# Altium schematic sheet Sheet1.SchDoc
size A2 portrait; Organization: Altium Limited; Address1: L3, 12a Rodborough Rd; Address2: Frenchs Forest; Address3: NSW; Address4: Australia 2086
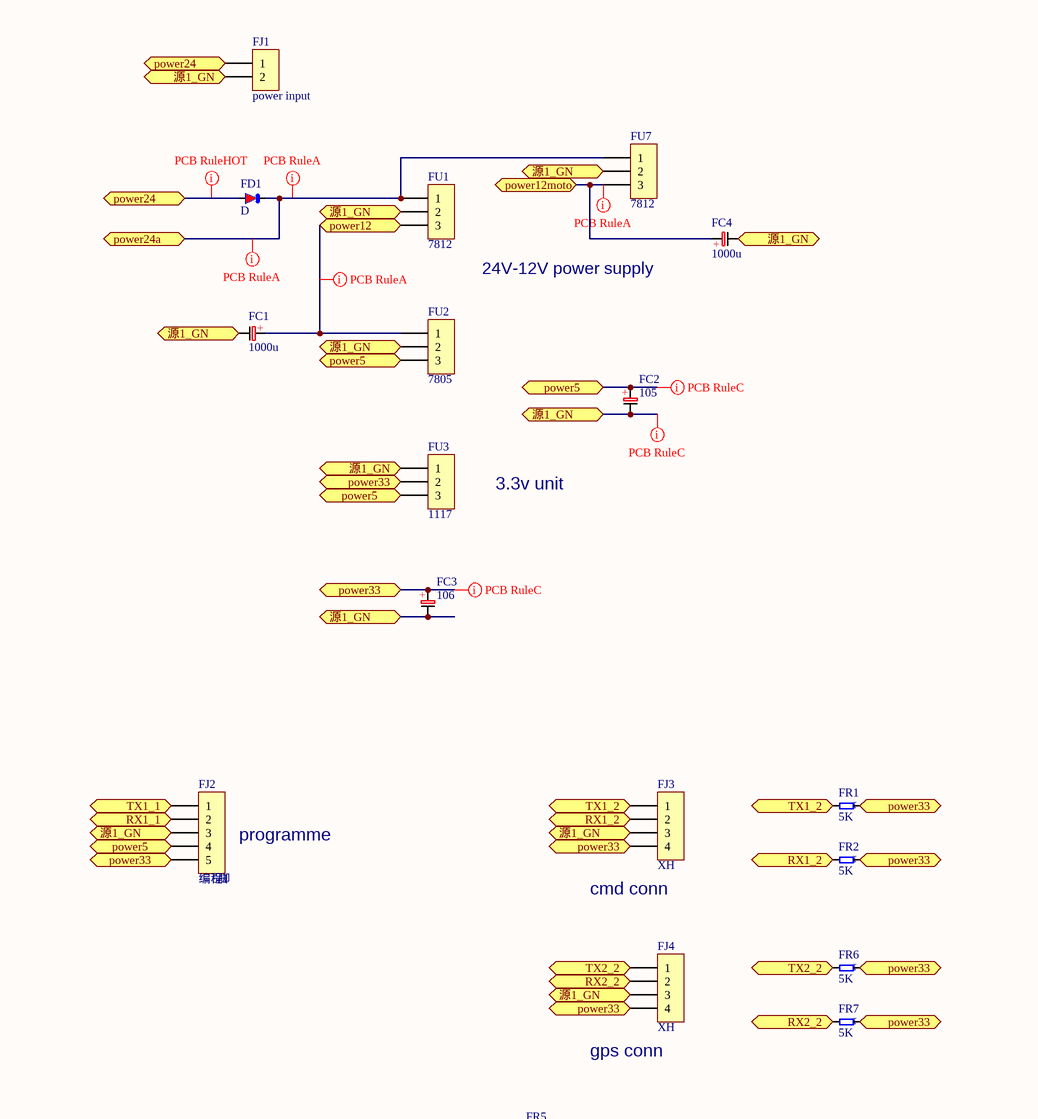
[diagram p0: Sheet1.SchDoc, top]
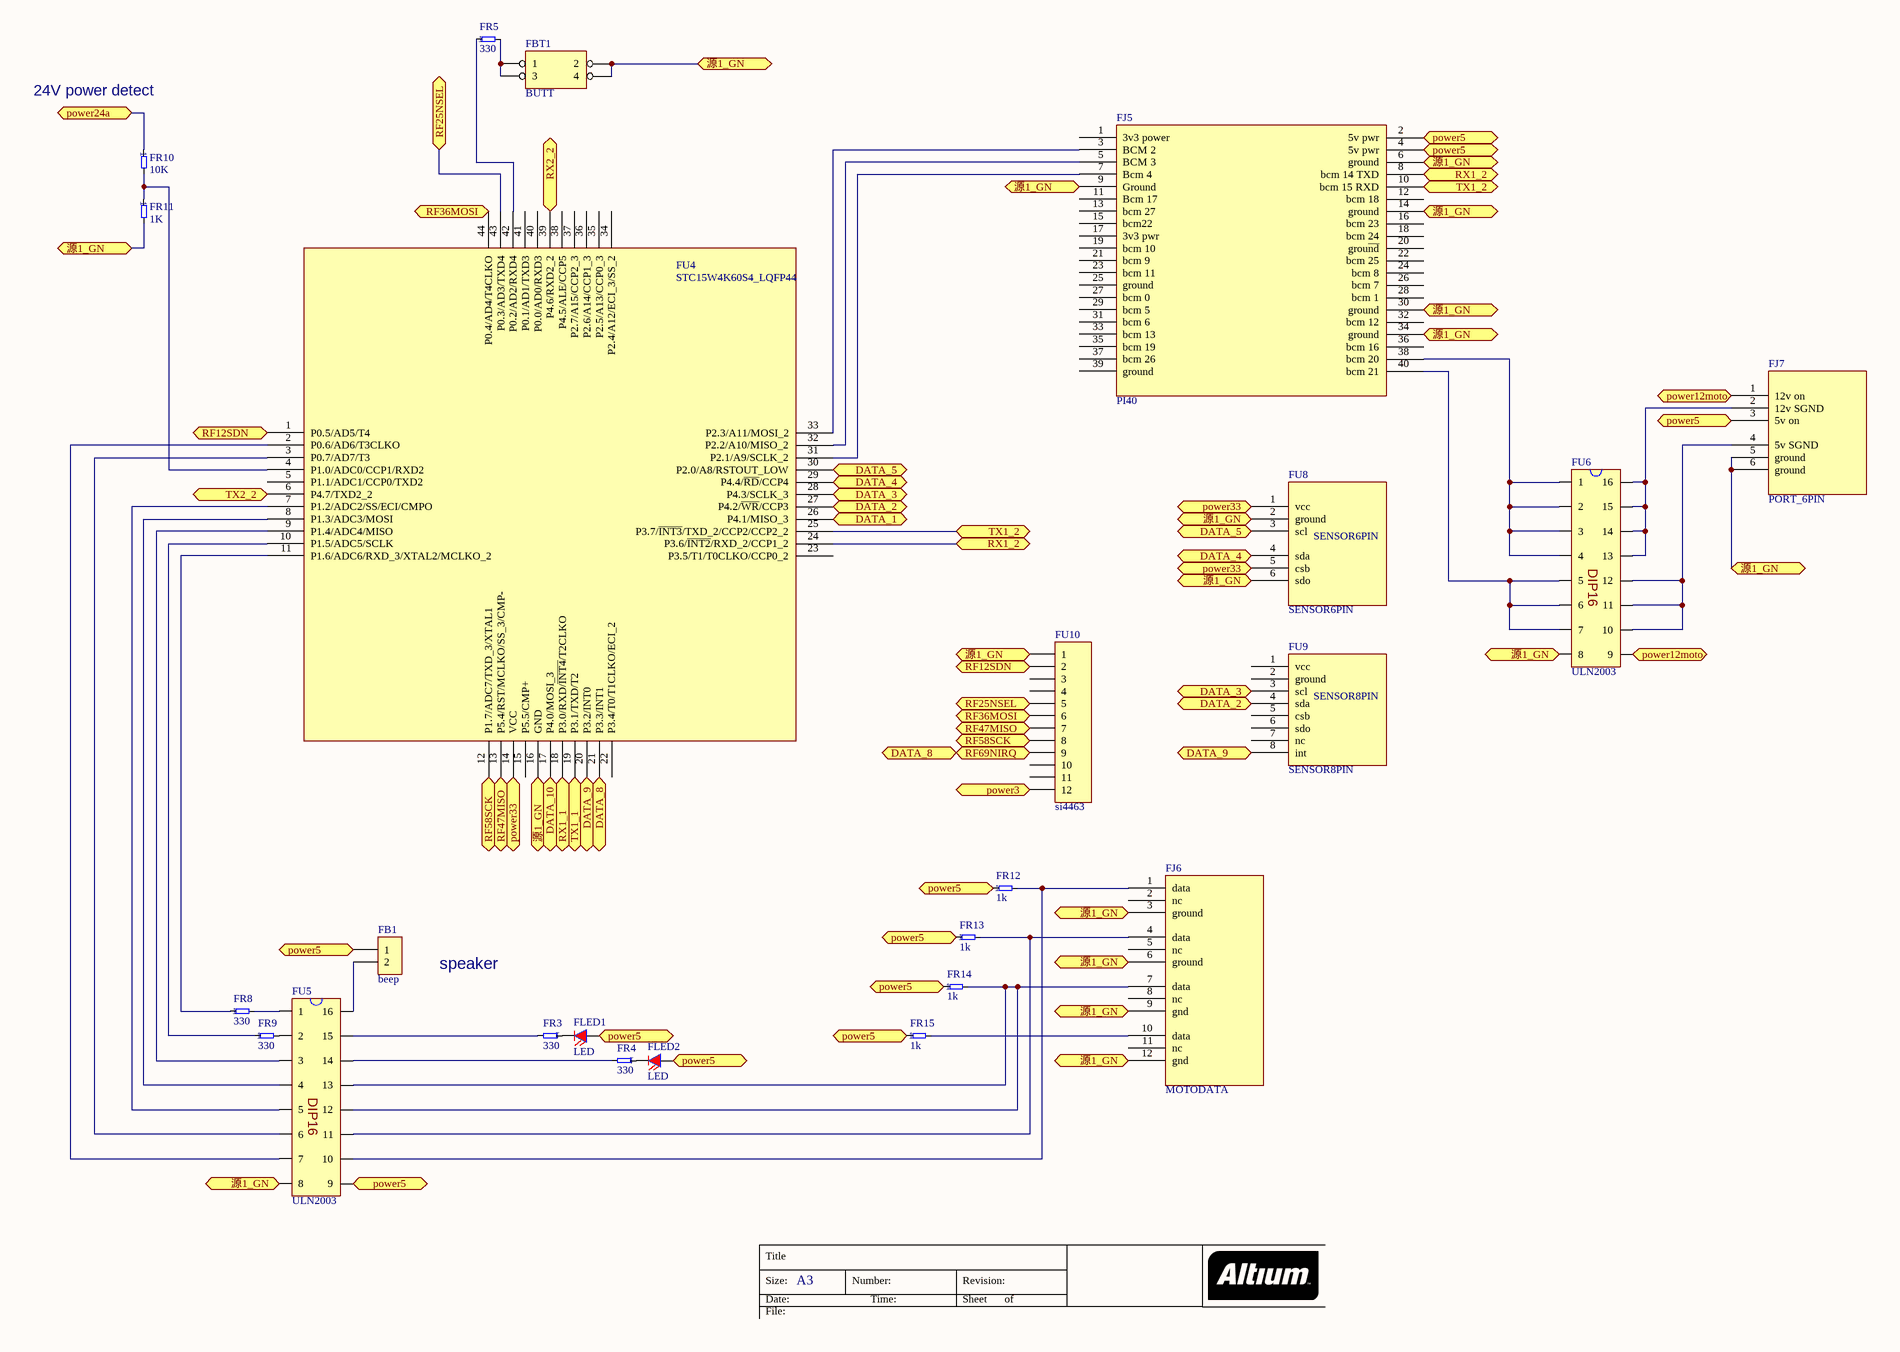
[diagram p1: Sheet1.SchDoc, bottom]

## Parts
FB1  beep  [BEEP_1]
FBT1  BUTT  [BUTT_01]
FC1  1000u  [CD-L_10]
FC2  105  [CAP_10uF]
FC3  106  [CD]
FC4  1000u  [CD-L_10]
FD1  D  [RESIST_1]
FJ1  power input  [DUAN5_2P]
FJ2  5脚  [CONN_PRG3]
FJ3  XH  [XH_P4]
FJ4  XH  [XH_P4]
FJ5  PI40  [PI_CONNECTOR]
FJ6  MOTODATA  [MOTODATA]
FJ7  PORT_6PIN  [DUAN5_6P]
FLED1  LED  [LED0805]
FLED2  LED  [LED0805]
FR1  5K  [LED0805]
FR2  5K  [LED0805]
FR3  330  [LED0805]
FR4  330  [LED0805]
FR5  330  [LED0805]
FR6  5K  [LED0805]
FR7  5K  [LED0805]
FR8  330  [LED0805]
FR9  330  [LED0805]
FR10  10K  [LED0805]
FR11  1K  [LED0805]
FR12  1k  [LED0805]
FR13  1k  [LED0805]
FR14  1k  [LED0805]
FR15  1k  [LED0805]
FU1  7812  [TO220_1]
FU2  7805  [TO220_1]
FU3  1117  [SOT223_4N_1]
FU4  STC15W4K60S4_LQFP44  [LQFP44]
FU5  ULN2003  [SOP16_SHORT]
FU6  ULN2003  [SOP16_SHORT]
FU7  7812  [TO220_1]
FU8  SENSOR6PIN  [SENSOR6PIN]
FU9  SENSOR8PIN  [SENSOR8PIN]
FU10  si4463  [ZY4463_01]

## Ports
DATA_1, DATA_2, DATA_3, DATA_4, DATA_5, DATA_8, DATA_9, DATA_10, power3, power5, power12, power12moto, power24, power24a, power33, RF12SDN, RF25NSEL, RF36MOSI, RF47MISO, RF58SCK, RF69NIRQ, RX1_1, RX1_2, RX2_2, TX1_1, TX1_2, TX2_2, 源1_GN

## Nets
DATA_1: FU4.26(P4.1/MISO_3) ; port DATA_1
DATA_2: FU4.27(P4.2/~{WR}/CCP3) FU9.4(sda) ; port DATA_2
DATA_3: FU4.28(P4.3/SCLK_3) FU9.3(scl) ; port DATA_3
DATA_4: FU4.29(P4.4/~{RD}/CCP4) FU8.4(sda) ; port DATA_4
DATA_5: FU4.30(P2.0/A8/RSTOUT_LOW) FU8.3(scl) ; port DATA_5
DATA_8: FU4.21(P3.3/INT1) FU10.9 ; port DATA_8, port RF69NIRQ
DATA_9: FU4.20(P3.2/INT0) FU9.8(int) ; port DATA_9
DATA_10: FU4.17(P4.0/MOSI_3) ; port DATA_10
power3: FU10.12 ; port power3
power5: FB1.1 FC2.1 FJ2.4 FJ5.2(5v_pwr) FJ5.4(5v_pwr) FJ7.3(5v_on) FLED1.A(a) FLED2.A(a) FR12.1 FR13.1 FR14.1 FR15.1 FU2.3 FU3.3 FU5.9 ; port power5
power12: FC1.1 FU1.3 FU2.1 ; port power12
power12moto: FC4.1 FJ7.1(12v_on) FU6.9 FU7.3 ; port power12moto
power24: FD1.A FJ1.1 ; port power24
power24a: FD1.K FR10.1 FU1.1 FU7.1 ; port power24a
power33: FC3.1 FJ2.5 FJ3.4 FJ4.4 FR1.1 FR2.1 FR6.1 FR7.1 FU3.2 FU4.14(VCC) FU8.1(vcc) FU8.5(csb) ; port power33
RF12SDN: FU4.1(P0.5/AD5/T4) FU10.2 ; port RF12SDN
RF25NSEL: FU4.43(P0.3/AD3/TXD4) FU10.5 ; port RF25NSEL
RF36MOSI: FU4.44(P0.4/AD4/T4CLKO) FU10.6 ; port RF36MOSI
RF47MISO: FU4.13(P5.4/RST/MCLKO/SS_3/CMP-) FU10.7 ; port RF47MISO
RF58SCK: FU4.12(P1.7/ADC7/TXD_3/XTAL1) FU10.8 ; port RF58SCK
RX1_1: FJ2.2 FU4.18(P3.0/RXD/~{INT4}/T2CLKO) ; port RX1_1
RX1_2: FJ3.2 FJ5.8(bcm_14_TXD) FR2.2 FU4.24(P3.6/~{INT2}/RXD_2/CCP1_2) ; port RX1_2
RX2_2: FJ4.2 FR7.2 FU4.39(P4.6/RXD2_2) ; port RX2_2
TX1_1: FJ2.1 FU4.19(P3.1/TXD/T2) ; port TX1_1
TX1_2: FJ3.1 FJ5.10(bcm_15_RXD) FR1.2 FU4.25(P3.7/~{INT3}/TXD_2/CCP2/CCP2_2) ; port TX1_2
TX2_2: FJ4.1 FR6.2 FU4.6(P4.7/TXD2_2) ; port TX2_2
源1_GN: FBT1.2 FBT1.4 FC1.2 FC2.2 FC3.2 FC4.2 FJ1.2 FJ2.3 FJ3.3 FJ4.3 FJ5.6(ground) FJ5.9(Ground) FJ5.14(ground) FJ5.30(ground) FJ5.34(ground) FJ6.3(ground) FJ6.6(ground) FJ6.9(gnd) FJ6.12(gnd) FJ7.5(ground) FJ7.6(ground) FR11.2 FU1.2 FU2.2 FU3.1 FU4.16(GND) FU5.8 FU6.8 FU7.2 FU8.2(ground) FU8.6(sdo) FU10.1 ; port 源1_GN
NetFB1_2: FB1.2 FU5.16
NetFBT1_1: FBT1.1 FBT1.3 FR5.2
NetFJ5_3: FJ5.3(BCM_2) FU4.33(P2.3/A11/MOSI_2)
NetFJ5_5: FJ5.5(BCM_3) FU4.32(P2.2/A10/MISO_2)
NetFJ5_7: FJ5.7(Bcm_4) FU4.31(P2.1/A9/SCLK_2)
NetFJ5_38: FJ5.38(bcm_20) FU6.1 FU6.2 FU6.3 FU6.4
NetFJ5_40: FJ5.40(bcm_21) FU6.5 FU6.6 FU6.7
NetFJ6_1: FJ6.1(data) FR12.2 FU5.10
NetFJ6_4: FJ6.4(data) FR13.2 FU5.11
NetFJ6_7: FJ6.7(data) FR14.2 FU5.12 FU5.13
NetFJ6_10: FJ6.10(data) FR15.2
NetFJ7_2: FJ7.2(12v_SGND) FU6.13 FU6.14 FU6.15 FU6.16
NetFJ7_4: FJ7.4(5v_SGND) FU6.10 FU6.11 FU6.12
NetFLED1_K: FLED1.K(k) FR3.1
NetFLED2_K: FLED2.K(k) FR4.1
NetFR3_2: FR3.2 FU5.15
NetFR4_2: FR4.2 FU5.14
NetFR5_1: FR5.1 FU4.42(P0.2/AD2/RXD4)
NetFR8_1: FR8.1 FU4.11(P1.6/ADC6/RXD_3/XTAL2/MCLKO_2)
NetFR8_2: FR8.2 FU5.1
NetFR9_1: FR9.1 FU4.10(P1.5/ADC5/SCLK)
NetFR9_2: FR9.2 FU5.2
NetFR10_2: FR10.2 FR11.1 FU4.4(P1.0/ADC0/CCP1/RXD2)
NetFU4_2: FU4.2(P0.6/AD6/T3CLKO) FU5.7
NetFU4_3: FU4.3(P0.7/AD7/T3) FU5.6
NetFU4_7: FU4.7(P1.2/ADC2/SS/ECI/CMPO) FU5.5
NetFU4_8: FU4.8(P1.3/ADC3/MOSI) FU5.4
NetFU4_9: FU4.9(P1.4/ADC4/MISO) FU5.3

Not connected (* = marked no-connect by the designer): FJ5 1(3v3_power) 11(Bcm_17) 12(bcm_18) 13(bcm_27) 15(bcm22) 16(bcm_23) 17(3v3_pwr) 18(bcm_24) 19(bcm_10) 20(grou~{nd}) 21(bcm_9) 22(bcm_25) 23(bcm_11) 24(bcm_8) 25(ground) 26(bcm_7) 27(bcm_0) 28(bcm_1) 29(bcm_5) 31(bcm_6) 32(bcm_12) 33(bcm_13) 35(bcm_19) 36(bcm_16) 37(bcm_26) 39(ground); FJ6 2(nc) 5(nc) 8(nc) 11(nc); FU4 5(P1.1/ADC1/CCP0/TXD2) 15(P5.5/CMP+) 22(P3.4/T0/T1CLKO/ECI_2) 23(P3.5/T1/T0CLKO/CCP0_2) 34(P2.4/A12/ECI_3/SS_2) 35(P2.5/A13/CCP0_3) 36(P2.6/A14/CCP1_3) 37(P2.7/A15/CCP2_3) 38(P4.5/ALE/CCP5) 40(P0.0/AD0/RXD3) 41(P0.1/AD1/TXD3); FU9 1(vcc) 2(ground) 5(csb) 6(sdo) 7(nc); FU10 3 4 10 11

## Layout directives
rule Width Constraint [Pref Width = 22mil    Min Width = 16mil    Max Width = 22mil]: power5, power33, 源1_GN
rule Width Constraint [Pref Width = 55mil    Min Width = 22mil    Max Width = 77mil]: power24
rule Width Constraint [Pref Width = 33mil    Min Width = 16mil    Max Width = 55mil]: power12, power12moto, power24a

## Notes on the sheet
- 24V-12V power supply
- 3.3v unit
- (near FJ2) programme
- (near FJ3) cmd conn
- (near FJ4) gps conn
- 24V power detect
- speaker
- Title
- Size:
- Date:
- A3
- Number:
- Time:
- Revision:
- Sheet
- of
- File:
- A2
- (in symbol C) 编程1
- (in symbol CD) +

## Library data of the parts
FB1 FJ2 FU1-FU3 FU7 = C: Connector
FBT1 = HEA
FC1-FC4 = CD
FD1 = D: pin to pad: A>1 K>2
FJ1 = CON2: Connector
FJ3 FJ4 = CON4: Connector
FJ5 = PI_CONNECTOR
FLED1 FLED2 = L: pin to pad: A>1 K>2
FR1-FR15 = R
FU5 FU6 = DIP16
FU10 = CON12: Connector